# EAGLE board AK4493-Combi10 (EAGLE 9.6.2)
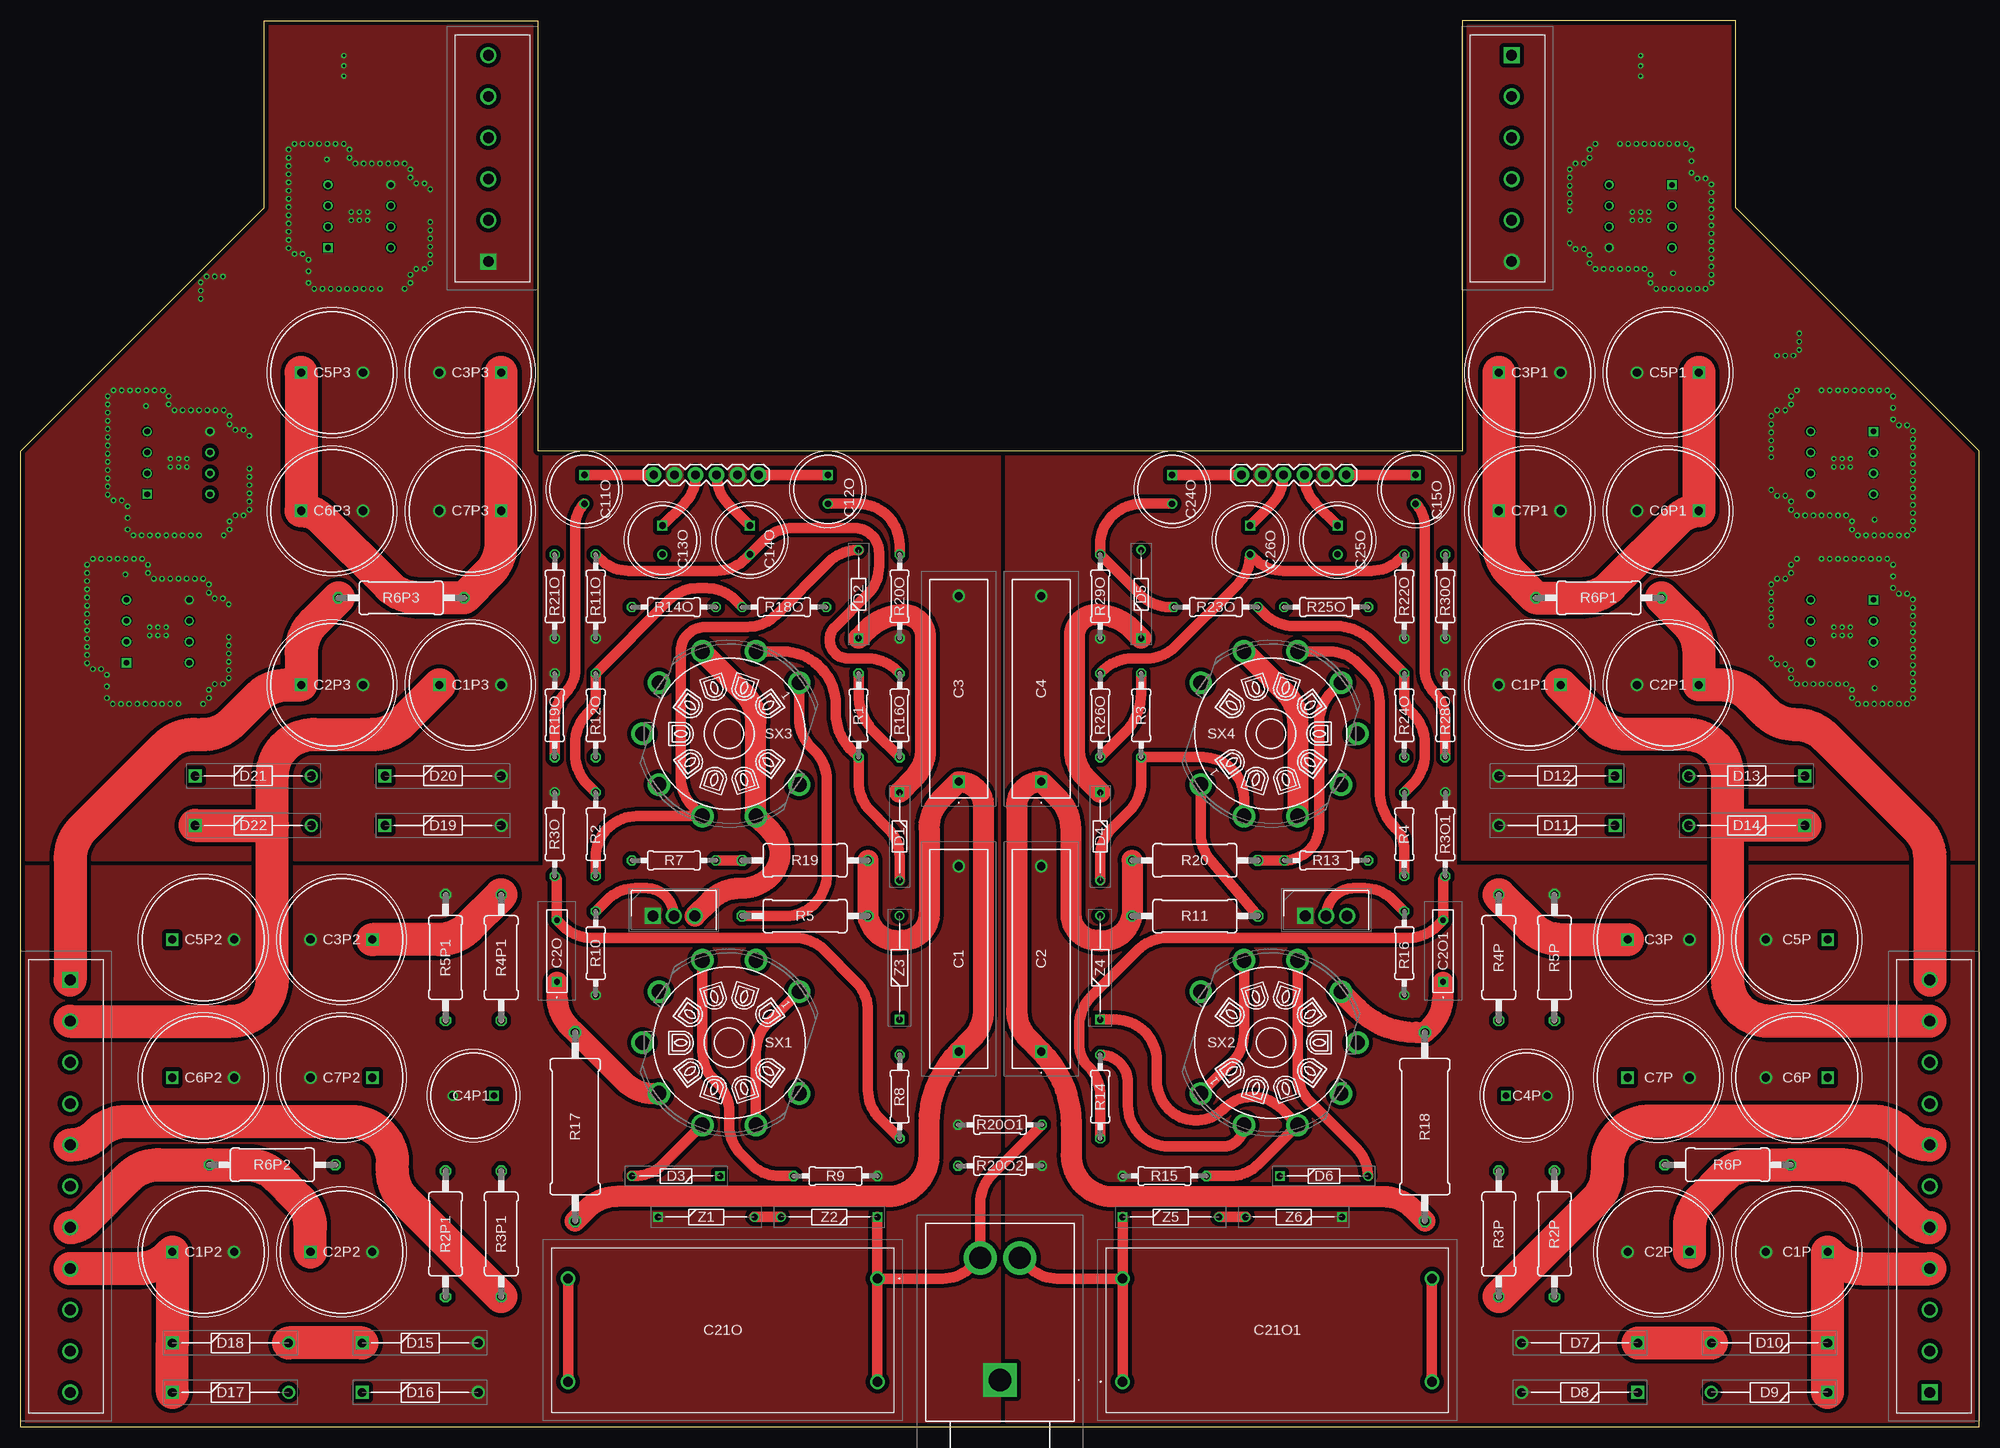
[diagram p3: board, top side]
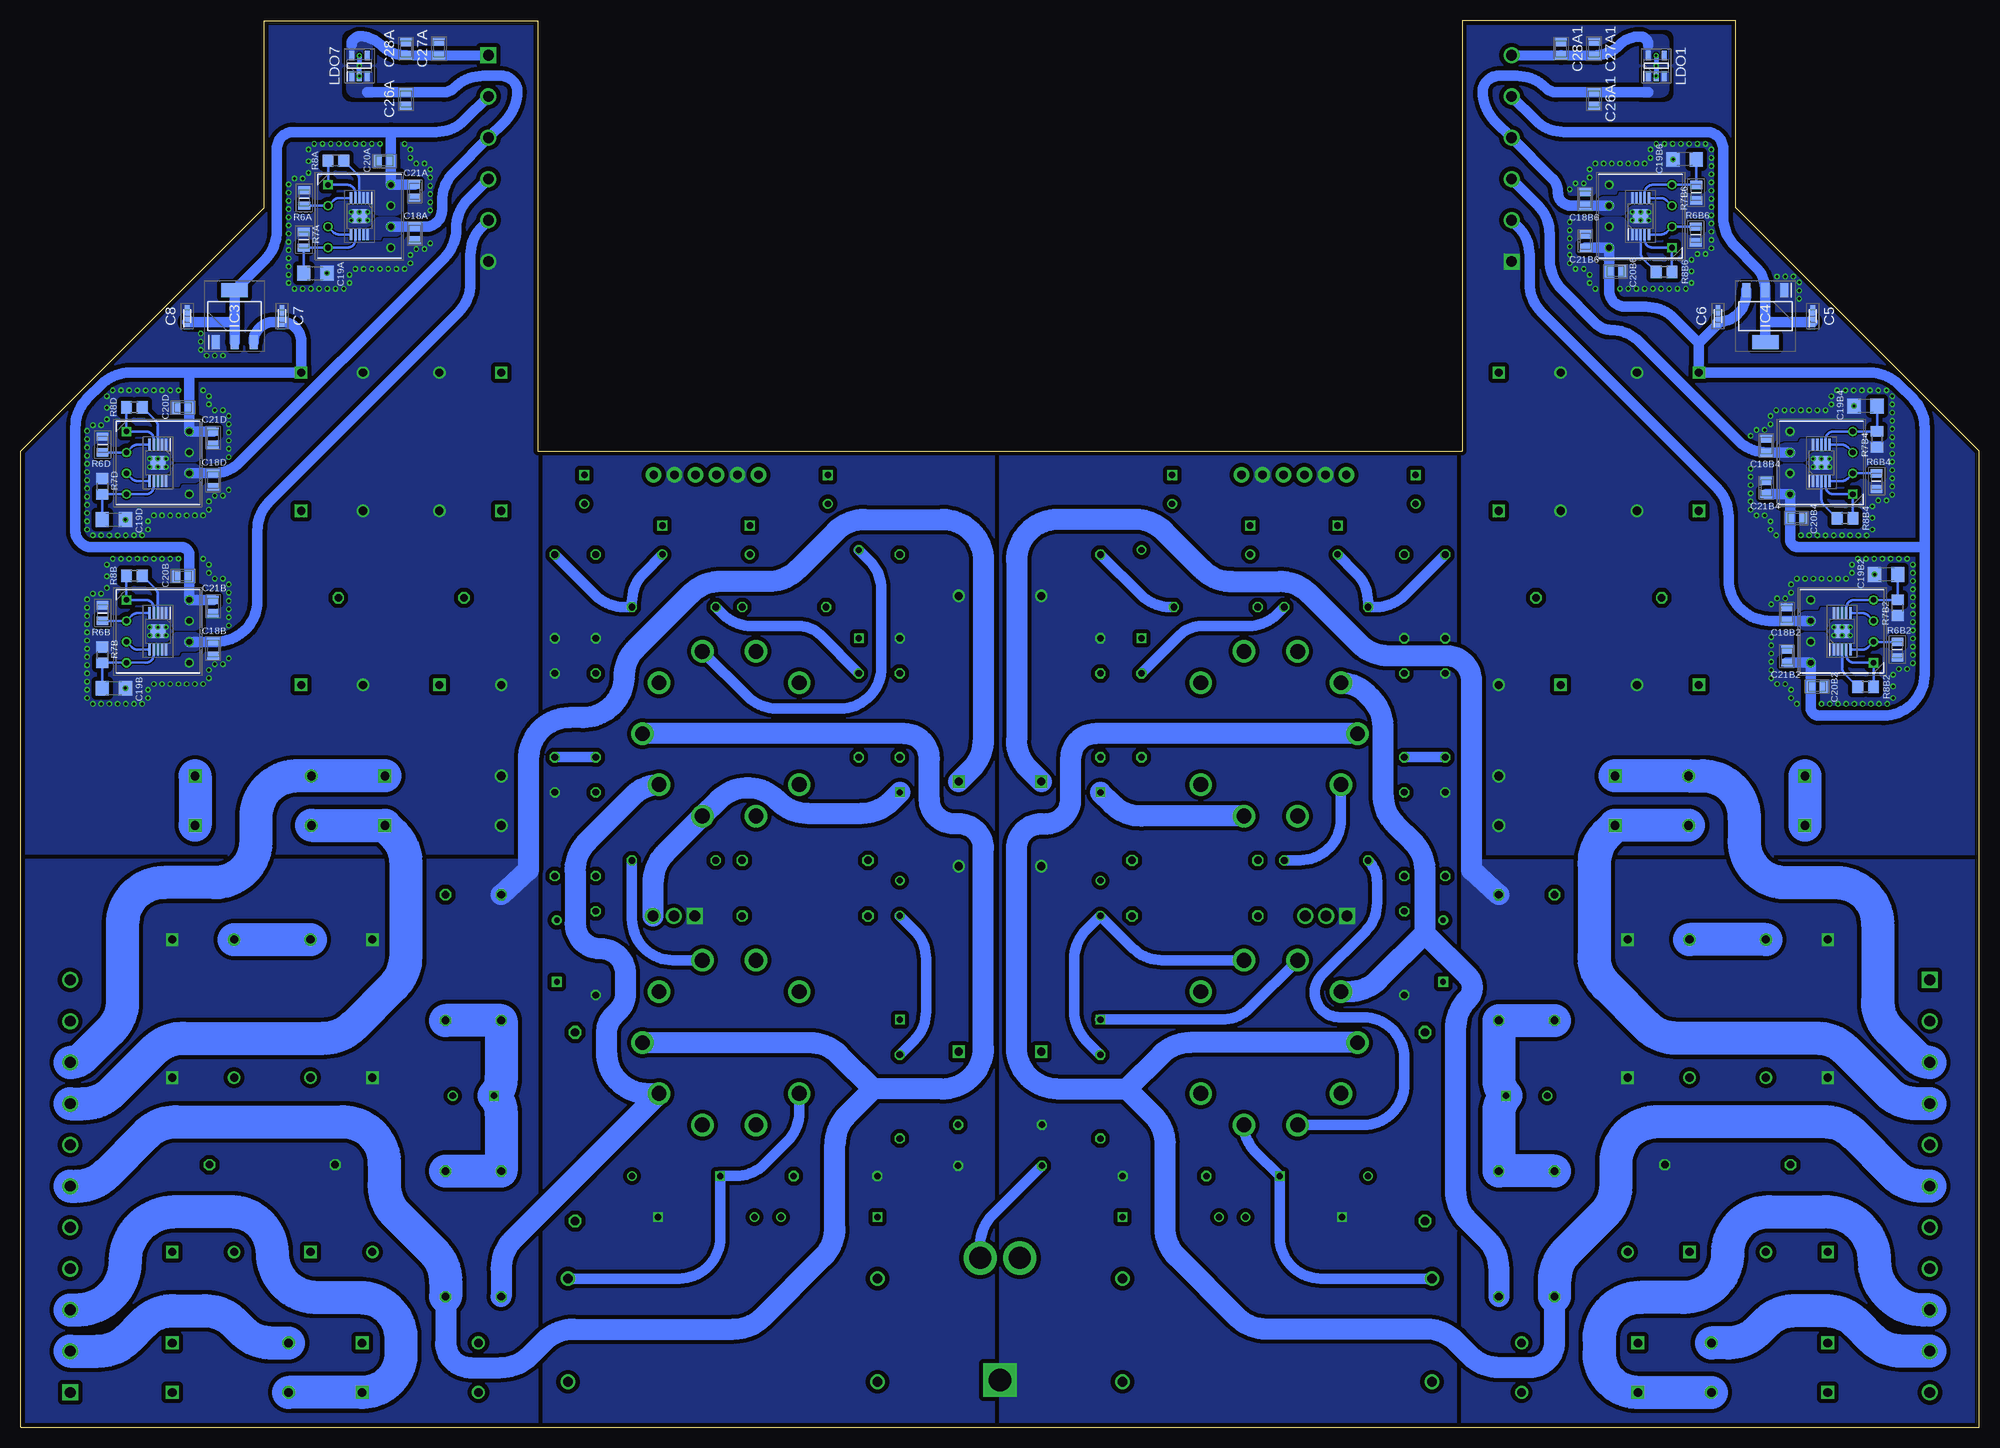
[diagram p4: board, bottom side, seen from below]

Size 237.38 x 170.5 mm. Coordinates in mm from the lower left corner, seen from the top.
Outline: 237.38,0 237.38,118.3 207.83,147.85 207.83,170.5 174.69,170.5 174.69,118.3 62.69,118.3 62.69,170.5 29.55,170.5 29.55,147.85 0,118.3 0,0 237.38,0
Copper layers (1*16): Top 0.035mm / dielectric 1.6mm / Bottom 0.035mm
Design rules "Elecrow_2-layer_PCB_eagle_rule": minimum track width 6mil, minimum drill 12mil, track to track 6mil, track to pad 6mil, pad to pad 6mil, via to via 8mil, smd to smd 0mil, copper to edge 20mil, drill to drill 10mil, minimum pad ring 6mil, minimum via ring 6mil, stop-mask expansion 0mil, vias tented up to drill 100mil, thermal gap 10mil
Net classes: 1 Signal: width 1.27 mm; 2 Power: width 2.54 mm

## Footprints (pad centres in the part's own frame; a part is rotated, then mirrored left to right if it is on the bottom)
MKP4G034705D00KSSD = drill 1 pad 1.5 square: 1 0,0 | drill 1 pad 1.5: 2 22.5,0
CAPPRD750W80D1475H4700 = drill 1 pad 1.5 square: 1 0,0 | drill 1 pad 1.5: 2 7.5,0
MKS4B031002A00JC00 = drill 0.7 pad 1.2 square: 1 0,0 | drill 0.7 pad 1.2: 2 7.5,0
CAPPRD500W60D1025H1750 = drill 0.8 pad 1.2 square: 1 0,0 | drill 0.8 pad 1.2: 2 5,0
CAPPM168X90N = smd 1.3 x 0.6: 1 -0.7,0; 2 0.7,0
CAPPRD350W60D825H1300 = drill 0.8 pad 1.2 square: 1 0,0 | drill 0.8 pad 1.2: 2 3.5,0
CAPC2013X140N = smd 0.96 x 1.44: 1 -0.82,0; 2 0.82,0
C1206 = smd 1.6 x 1.8: 1 -1.4,0; 2 1.4,0 | drill 0.35: DGND 1.4,0
CAPC2012X135N = smd 0.96 x 1.39: 1 -0.79,0; 2 0.79,0
DCP4G056007GD4KSSD = drill 1.2 pad 1.8: 1 0,0; 2 37.5,0; 3 37.5,12.5; 4 0,12.5
DIOAD1068W53L380D172 = drill 0.75 pad 1.15 square: 1 0,0 | drill 0.75 pad 1.15: 2 10.7,0
DIOAD1405W86L465D235 = drill 1.05 pad 1.575 square: 1 0,0 | drill 1.05 pad 1.575: 2 14.1,0
SOP50P490X110-11N = smd 1.425 x 0.3: 1 -2.212,1; 2 -2.212,0.5; 3 -2.212,0; 4 -2.212,-0.5; 5 -2.212,-1; 6 2.212,-1; 7 2.212,-0.5; 8 2.212,0; 9 2.212,0.5; 10 2.212,1 | smd 1.68 x 1.88: 11 0,0 | drill 0.305 pad 0.61: P$1 -0.498,0; P$2 0.498,0; P$3 -0.498,0.995; P$4 0.498,0.995; P$5 -0.498,-0.995; P$6 0.498,-0.995
SOT230P700X180-4N = smd 1.75 x 0.95: 1 -3.15,2.3; 2 -3.15,0; 3 -3.15,-2.3 | smd 1.75 x 3.2: 4 3.15,0
DIPS762W51P254L1016H390Q8N = drill 0.7 pad 1.1 square: 1 0,0 | drill 0.7 pad 1.1: 2 0,-2.54; 3 0,-5.08; 4 0,-7.62; 5 7.62,-7.62; 6 7.62,-5.08; 7 7.62,-2.54; 8 7.62,0
1X06 = drill 1.016 pad 1.88: 1 0,0; 2 2.54,0; 3 5.08,0; 4 7.62,0; 5 10.16,0; 6 12.7,0
SJ63033A = drill 2.69 pad 4.035 square: 1 0,0 | drill 2.69 pad 4.035: 2 14.8,-2.4; 3 14.8,2.4
1935255 = drill 1.3 pad 1.95 square: 1 0,0 | drill 1.3 pad 1.95: 2 5,0; 3 10,0; 4 15,0; 5 20,0; 6 25,0; 7 30,0; 8 35,0; 9 40,0; 10 45,0; 11 50,0
1935200 = drill 1.3 pad 1.95 square: 1 0,0 | drill 1.3 pad 1.95: 2 5,0; 3 10,0; 4 15,0; 5 20,0; 6 25,0
SOT95P280X145-5N = smd 1.2 x 0.6: 1 -1.25,0.95; 2 -1.25,0; 3 -1.25,-0.95; 4 1.25,-0.95; 5 1.25,0.95 | drill 0.305 pad 0.61: DGND -1.25,0; DGND2 0,0; DGND3 1.25,0
0207/10 = drill 0.813 octagon: 1 -5.08,0; 2 5.08,0
0411/15 = drill 0.914 octagon: 1 -7.62,0; 2 7.62,0
RESC2012X60N = smd 1 x 1.4: 1 -0.95,0; 2 0.95,0
RESC2012X65N = smd 1 x 1.45: 1 -0.95,0; 2 0.95,0
R0805 = smd 1.3 x 1.5: 1 -0.95,0; 2 0.95,0
0617/22 = drill 1.016 octagon: 1 -11.43,0; 2 11.43,0
VT9-PT = drill 1.8 pad 2.4: 1 6.172,8.495; 2 0,10.5; 3 -6.172,8.495; 4 -9.986,3.245; 5 -9.986,-3.245; 6 -6.172,-8.495; 7 0,-10.5; 8 6.172,-8.495; 9 9.986,-3.244
TO254P482X997X2018-3P = drill 1.29 pad 1.935 square: 1 0,0 | drill 1.29 pad 1.935: 2 2.54,0; 3 5.08,0
DIOAD1165W56L425D185 = drill 0.75 pad 1.15 square: 1 0,0 | drill 0.75 pad 1.15: 2 11.7,0
DIOAD1256W56L444D203 = drill 0.75 pad 1.15 square: 1 0,0 | drill 0.75 pad 1.15: 2 12.6,0

## Placement (x,y rotation side)
C1  MKP4G034705D00KSSD  [MKP4G034705D00KSSD]  113.69,45.5 90 top
C1P  68u  [CAPPRD750W80D1475H4700]  219,21.23 180 top
C1P1  68u  [CAPPRD750W80D1475H4700]  186.63,89.97 180 top
C1P2  68u  [CAPPRD750W80D1475H4700]  18.38,21.23 0 top
C1P3  68u  [CAPPRD750W80D1475H4700]  50.74,89.97 0 top
C2  MKP4G034705D00KSSD  [MKP4G034705D00KSSD]  123.69,45.5 90 top
C2O  0.1uF, 35V  [MKS4B031002A00JC00]  64.99,53.95 90 top
C2O1  0.1uF, 35V  [MKS4B031002A00JC00]  172.39,53.95 90 top
C2P  68u  [CAPPRD750W80D1475H4700]  202.25,21.23 180 top
C2P1  68u  [CAPPRD750W80D1475H4700]  203.38,89.97 180 top
C2P2  68u  [CAPPRD750W80D1475H4700]  35.12,21.23 0 top
C2P3  68u  [CAPPRD750W80D1475H4700]  33.99,89.97 0 top
C3  MKP4G034705D00KSSD  [MKP4G034705D00KSSD]  113.69,78.25 90 top
C3P  68u  [CAPPRD750W80D1475H4700]  194.75,59.1 0 top
C3P1  68u  [CAPPRD750W80D1475H4700]  179.13,127.83 0 top
C3P2  68u  [CAPPRD750W80D1475H4700]  42.62,59.1 180 top
C3P3  68u  [CAPPRD750W80D1475H4700]  58.24,127.83 180 top
C4  MKP4G034705D00KSSD  [MKP4G034705D00KSSD]  123.69,78.25 90 top
C4P  UCY2E220MPD1TD  [CAPPRD500W60D1025H1750]  180,40.16 0 top
C4P1  UCY2E220MPD1TD  [CAPPRD500W60D1025H1750]  57.37,40.16 180 top
C5  TCM1A106M8R  [CAPPM168X90N]  20.19,134.68 90 bottom
C5P  68u  [CAPPRD750W80D1475H4700]  219,59.1 180 top
C5P1  68u  [CAPPRD750W80D1475H4700]  203.38,127.83 180 top
C5P2  68u  [CAPPRD750W80D1475H4700]  18.38,59.1 0 top
C5P3  68u  [CAPPRD750W80D1475H4700]  33.99,127.83 0 top
C6  TCM1A106M8R  [CAPPM168X90N]  31.68,134.68 90 bottom
C6P  68u  [CAPPRD750W80D1475H4700]  219,42.35 180 top
C6P1  68u  [CAPPRD750W80D1475H4700]  203.38,111.08 180 top
C6P2  68u  [CAPPRD750W80D1475H4700]  18.38,42.35 0 top
C6P3  68u  [CAPPRD750W80D1475H4700]  33.99,111.08 0 top
C7  TCM1A106M8R  [CAPPM168X90N]  205.7,134.68 90 bottom
C7P  68u  [CAPPRD750W80D1475H4700]  194.75,42.35 0 top
C7P1  68u  [CAPPRD750W80D1475H4700]  179.13,111.08 0 top
C7P2  68u  [CAPPRD750W80D1475H4700]  42.62,42.35 180 top
C7P3  68u  [CAPPRD750W80D1475H4700]  58.24,111.08 180 top
C8  TCM1A106M8R  [CAPPM168X90N]  217.19,134.68 90 bottom
C11O  100uF  [CAPPRD350W60D825H1300]  68.31,115.42 270 top
C12O  100uF  [CAPPRD350W60D825H1300]  97.84,115.42 270 top
C13O  100uF  [CAPPRD350W60D825H1300]  77.77,109.28 270 top
C14O  100uF  [CAPPRD350W60D825H1300]  88.38,109.28 270 top
C15O  100uF  [CAPPRD350W60D825H1300]  169.06,115.42 270 top
C18A  4.7u  [CAPC2013X140N]  189.62,144.69 270 bottom
C18B  4.7u  [CAPC2013X140N]  214.05,94.37 270 bottom
C18B2  4.7u  [CAPC2013X140N]  23.33,98.55 90 bottom
C18B4  4.7u  [CAPC2013X140N]  25.83,118.98 90 bottom
C18B6  4.7u  [CAPC2013X140N]  47.75,148.87 90 bottom
C18D  4.7u  [CAPC2013X140N]  214.05,114.8 270 bottom
C19A  22u  [C1206]  201.66,139.89 0 bottom
C19B  22u  [C1206]  226.08,89.57 0 bottom
C19B2  22u  [C1206]  11.3,103.36 180 bottom
C19B4  22u  [C1206]  13.8,123.78 180 bottom
C19B6  22u  [C1206]  35.72,153.68 180 bottom
C19D  22u  [C1206]  226.08,109.99 0 bottom
C20A  10u  [CAPC2012X135N]  193.29,153.47 180 bottom
C20B  10u  [CAPC2012X135N]  217.72,103.16 180 bottom
C20B2  10u  [CAPC2012X135N]  19.66,89.77 0 bottom
C20B4  10u  [CAPC2012X135N]  22.16,110.2 0 bottom
C20B6  10u  [CAPC2012X135N]  44.08,140.09 0 bottom
C20D  10u  [CAPC2012X135N]  217.72,123.58 180 bottom
C21A  0.1u  [CAPC2012X135N]  189.62,149.8 270 bottom
C21B  0.1u  [CAPC2012X135N]  214.05,99.48 270 bottom
C21B2  0.1u  [CAPC2012X135N]  23.33,93.44 90 bottom
C21B4  0.1u  [CAPC2012X135N]  25.83,113.87 90 bottom
C21B6  0.1u  [CAPC2012X135N]  47.75,143.76 90 bottom
C21D  0.1u  [CAPC2012X135N]  214.05,119.91 270 bottom
C21O  30uF/400V  [DCP4G056007GD4KSSD]  103.84,18 180 top
C21O1  30uF/400V  [DCP4G056007GD4KSSD]  133.54,5.5 0 top
C24O  100uF  [CAPPRD350W60D825H1300]  139.54,115.42 270 top
C25O  100uF  [CAPPRD350W60D825H1300]  159.61,109.28 270 top
C26A  4.7u, Ceramic Capacitor X7R  [CAPC2013X140N]  190.69,161 270 bottom
C26A1  4.7u, Ceramic Capacitor X7R  [CAPC2013X140N]  46.69,161 270 bottom
C26O  100uF  [CAPPRD350W60D825H1300]  149,109.28 270 top
C27A  4.7u, Ceramic Capacitor X7R  [CAPC2013X140N]  186.69,167.09 90 bottom
C27A1  4.7u, Ceramic Capacitor X7R  [CAPC2013X140N]  46.69,167.09 90 bottom
C28A  0.1u, Ceramic Capacitor X7R  [CAPC2012X135N]  190.69,167.09 90 bottom
C28A1  0.1u, Ceramic Capacitor X7R  [CAPC2012X135N]  50.69,167.09 90 bottom
D1  1N4148-T50R  [DIOAD1068W53L380D172]  106.51,76.95 270 top
D2  1N4148-T50R  [DIOAD1068W53L380D172]  101.54,95.62 90 top
D3  1N4148-T50R  [DIOAD1068W53L380D172]  84.78,30.42 180 top
D4  1N4148-T50R  [DIOAD1068W53L380D172]  130.83,76.95 270 top
D5  1N4148-T50R  [DIOAD1068W53L380D172]  135.8,95.62 90 top
D6  1N4148-T50R  [DIOAD1068W53L380D172]  152.59,30.42 0 top
D7  1N4007FFG  [DIOAD1405W86L465D235]  196,10.2 180 top
D8  1N4007FFG  [DIOAD1405W86L465D235]  196,4.2 180 top
D9  1N4007FFG  [DIOAD1405W86L465D235]  219,4.2 180 top
D10  1N4007FFG  [DIOAD1405W86L465D235]  219,10.2 180 top
D11  1N4007FFG  [DIOAD1405W86L465D235]  193.23,72.94 180 top
D12  1N4007FFG  [DIOAD1405W86L465D235]  193.23,78.94 180 top
D13  1N4007FFG  [DIOAD1405W86L465D235]  216.23,78.94 180 top
D14  1N4007FFG  [DIOAD1405W86L465D235]  216.23,72.94 180 top
D15  1N4007FFG  [DIOAD1405W86L465D235]  41.38,10.2 0 top
D16  1N4007FFG  [DIOAD1405W86L465D235]  41.38,4.2 0 top
D17  1N4007FFG  [DIOAD1405W86L465D235]  18.38,4.2 0 top
D18  1N4007FFG  [DIOAD1405W86L465D235]  18.38,10.2 0 top
D19  1N4007FFG  [DIOAD1405W86L465D235]  44.14,72.94 0 top
D20  1N4007FFG  [DIOAD1405W86L465D235]  44.14,78.94 0 top
D21  1N4007FFG  [DIOAD1405W86L465D235]  21.14,78.94 0 top
D22  1N4007FFG  [DIOAD1405W86L465D235]  21.14,72.94 0 top
IC1  LT3042  [SOP50P490X110-11N]  220.74,116.89 270 bottom
IC2  LT3042  [SOP50P490X110-11N]  196.31,146.78 270 bottom
IC3  LM1117MPX-5.0_NOPB  [SOT230P700X180-4N]  211.44,134.68 90 bottom
IC4  LM1117MPX-5.0_NOPB  [SOT230P700X180-4N]  25.93,134.68 270 bottom
IC5  LT3042  [SOP50P490X110-11N]  220.74,96.46 270 bottom
IC6  LT3042  [SOP50P490X110-11N]  16.64,96.46 90 bottom
IC8  LT3042  [SOP50P490X110-11N]  19.14,116.89 90 bottom
IC10  LT3042  [SOP50P490X110-11N]  41.06,146.78 90 bottom
J1  XR2A-0811-N  [DIPS762W51P254L1016H390Q8N]  224.55,120.7 0 bottom
J2  [1X06]  147.95,115.42 0 top
J3  SJ-63033A  [SJ63033A]  118.69,5.7 90 top
J4  1935255  [1935255]  6,54.2 270 top
J5  XR2A-0811-N  [DIPS762W51P254L1016H390Q8N]  200.12,150.59 0 bottom
J6  1935255  [1935255]  231.38,4.2 90 top
J7  1935200  [1935200]  180.69,166.3 270 top
J8  XR2A-0811-N  [DIPS762W51P254L1016H390Q8N]  12.83,92.65 180 bottom
J9  1935200  [1935200]  56.69,141.3 90 top
J10  XR2A-0811-N  [DIPS762W51P254L1016H390Q8N]  15.33,113.08 180 bottom
J12  XR2A-0811-N  [DIPS762W51P254L1016H390Q8N]  37.25,142.97 180 bottom
J13  [1X06]  89.42,115.42 180 top
J17  XR2A-0811-N  [DIPS762W51P254L1016H390Q8N]  224.55,100.27 0 bottom
LDO1  LP5907-1.8V  [SOT95P280X145-5N]  39.16,165.02 90 bottom
LDO7  LP5907-1.8V  [SOT95P280X145-5N]  196.31,165.02 90 bottom
R1  1k  [0207/10]  101.54,86.28 90 top
R2  1k  [0207/10]  69.69,71.87 90 top
R2P  220  [0411/15]  185.88,23.41 270 top
R2P1  220  [0411/15]  51.5,23.41 270 top
R3  1k  [0207/10]  135.8,86.28 90 top
R3O  1M*  [0207/10]  64.72,71.87 90 top
R3O1  1M*  [0207/10]  172.66,71.87 90 top
R3P  220  [0411/15]  179.13,23.41 90 top
R3P1  220  [0411/15]  58.24,23.41 90 top
R4  1k  [0207/10]  167.69,71.87 90 top
R4P  300k  [0411/15]  179.13,56.91 90 top
R4P1  300k  [0411/15]  58.24,56.91 90 top
R5  15k  [0411/15]  95.07,61.95 0 top
R5P  100k  [0411/15]  185.88,56.91 270 top
R5P1  100k  [0411/15]  51.5,56.91 270 top
R6A  1k  [RESC2012X60N]  203.01,149 90 bottom
R6B  1k  [RESC2012X60N]  227.43,98.68 90 bottom
R6B2  1k  [RESC2012X60N]  9.95,94.24 270 bottom
R6B4  1k  [RESC2012X60N]  12.45,114.67 270 bottom
R6B6  1k  [RESC2012X60N]  34.37,144.56 270 bottom
R6D  1k  [RESC2012X60N]  227.43,119.11 90 bottom
R6P  330  [0411/15]  206.88,31.79 0 top
R6P1  330  [0411/15]  191.26,100.53 0 top
R6P2  330  [0411/15]  30.5,31.79 180 top
R6P3  330  [0411/15]  46.12,100.53 180 top
R7  1k  [0207/10]  79.16,68.7 0 top
R7A  33k  [RESC2012X65N]  203.06,143.92 90 bottom
R7B  33k  [R0805]  227.48,93.6 90 bottom
R7B2  33k  [R0805]  9.9,99.32 270 bottom
R7B4  33k  [R0805]  12.4,119.75 270 bottom
R7B6  33k  [RESC2012X65N]  34.32,149.64 270 bottom
R7D  33k  [R0805]  227.48,114.03 90 bottom
R8  1k  [0207/10]  106.51,40.05 270 top
R8A  200k  [R0805]  199.17,153.52 180 bottom
R8B  200k  [R0805]  223.6,103.21 180 bottom
R8B2  200k  [R0805]  13.78,89.72 0 bottom
R8B4  200k  [R0805]  16.28,110.15 0 bottom
R8B6  200k  [R0805]  38.2,140.04 0 bottom
R8D  200k  [R0805]  223.6,123.63 180 bottom
R9  249  [0207/10]  98.76,30.42 180 top
R10  76.8  [0207/10]  69.69,57.45 90 top
R11  15k  [0411/15]  142.31,61.95 180 top
R11O  10k  [0207/10]  69.69,100.7 270 top
R12O  182  [0207/10]  69.69,86.28 270 top
R13  1k  [0207/10]  158.21,68.7 180 top
R14  1k  [0207/10]  130.83,40.05 270 top
R14O  182  [0207/10]  79.16,99.4 180 top
R15  249  [0207/10]  138.62,30.42 0 top
R16  76.8  [0207/10]  167.69,57.45 90 top
R16O  182  [0207/10]  106.51,86.28 90 top
R17  402  [0617/22]  67.2,36.42 90 top
R18  402  [0617/22]  170.17,36.42 270 top
R18O  182  [0207/10]  92.53,99.4 0 top
R19  15k  [0411/15]  95.07,68.7 0 top
R19O  10k  [0207/10]  64.72,86.28 270 top
R20  15k  [0411/15]  142.31,68.7 0 top
R20O  10k  [0207/10]  106.51,100.7 270 top
R20O1  10k  [0207/10]  118.69,36.65 0 top
R20O2  10k  [0207/10]  118.69,31.68 180 top
R21O  10k  [0207/10]  64.72,100.7 90 top
R22O  10k  [0207/10]  167.69,100.7 270 top
R23O  182  [0207/10]  144.85,99.4 180 top
R24O  182  [0207/10]  167.69,86.28 270 top
R25O  182  [0207/10]  158.21,99.4 0 top
R26O  182  [0207/10]  130.83,86.28 90 top
R28O  10k  [0207/10]  172.66,86.28 270 top
R29O  10k  [0207/10]  130.83,100.7 270 top
R30O  10k  [0207/10]  172.66,100.7 90 top
SX1  VT9-PT  [VT9-PT]  85.87,46.6 342 top
SX2  VT9-PT  [VT9-PT]  151.51,46.6 162 top
SX3  VT9-PT  [VT9-PT]  85.87,84.05 342 top
SX4  VT9-PT  [VT9-PT]  151.51,84.05 162 top
U1  LM317MTG  [TO254P482X997X2018-3P]  76.62,61.95 0 top
U2  LM317MTG  [TO254P482X997X2018-3P]  155.67,61.95 0 top
Z1  [DIOAD1165W56L425D185]  77.23,25.45 0 top
Z2  [DIOAD1165W56L425D185]  103.84,25.45 180 top
Z3  1N750  [DIOAD1256W56L444D203]  106.51,49.39 90 top
Z4  1N750  [DIOAD1256W56L444D203]  130.83,49.39 90 top
Z5  [DIOAD1165W56L425D185]  133.54,25.45 0 top
Z6  [DIOAD1165W56L425D185]  160.14,25.45 180 top

## Tracks (layer width: path | path; a pad name or v marks a point on that pad's centre or on a via)
6.3_VAC_BLU/1
  Bottom 4: J4.4 7.62,39.2 arc45 11.15,40.66 16.16,45.67 arc-45 19.69,47.13 36.75,47.13 arc45 40.29,48.6 45.22,53.54 arc45 46.69,57.07 46.69,68.32 arc45 45.22,71.86 D19.1 D22.2
6.3_VAC_BLU/2
  Bottom 4: J6.8 229.76,39.2 arc-45 226.22,40.66 221.22,45.67 arc45 217.68,47.13 200.63,47.13 arc-45 197.09,48.6 192.15,53.54 arc-45 190.69,57.07 190.69,68.32 arc-45 192.15,71.86 D11.1 D14.2
6.3_VAC_GRN/1
  Bottom 4: J4.3 arc45 7.71,44.91 10.87,48.07 arc45 12.34,51.61 12.34,61 arc-90 17.34,66 23.5,66 arc90 28.5,71 28.5,73.94 arc-90 33.5,78.94 D21.2 D20.1
6.3_VAC_GRN/2
  Bottom 4: D12.1 D13.2 203.88,78.94 arc-90 208.88,73.94 208.88,71 arc90 213.88,66 220.04,66 arc-90 225.04,61 225.04,51.61 arc45 226.51,48.07 229.67,44.91 arc45 J6.9
66.3VAC/BRN/1
  Top 4: R3P1.1 46.53,27.51 arc-45 45.06,31.05 45.06,32.05 arc90 40.06,37.05 12.81,37.05 arc45 9.28,35.59 9.22,35.53 arc-45 J4.5
  Bottom 2.54: R3P1.1 58.24,19.23 arc-45 59.71,22.77 62.02,25.08 arc45 63.49,28.62 63.49,48.33 arc45 62.02,51.86 arc-90 62.02,54.68 67.2,59.86 | 67.2,59.86 72.82,54.24 arc45 76.36,52.77 SX1.4 | SX3.4 arc45 74.29,88.94 73.75,88.41 arc45 72.29,84.87 72.29,76.67 arc-45 70.82,73.14 68.67,70.98 arc45 67.2,67.44 67.2,59.86
66.3VAC/BRN/2
  Top 4: R3P.1 190.85,27.51 arc45 192.31,31.05 192.31,32.05 arc-90 197.31,37.05 224.56,37.05 arc-45 228.1,35.59 228.15,35.53 arc45 J6.7
  Bottom 2.54: R3P.1 179.13,19.23 arc45 177.67,22.77 SX2.4 161.39,40.43 arc90 166.39,45.43 166.39,47.76 arc45 165.51,49.88 164.97,50.42 arc-45 164.09,52.54 164.09,55 arc-90 167.09,58 167.17,58 arc90 170.17,61 170.17,67.44 arc45 168.71,70.98 163.09,76.6 arc45 SX4.4
66.3VAC/ORG/1
  Bottom 2.54: 103.32,40.99 99.18,45.14 arc45 95.64,46.6 SX1.5 | 103.32,40.99 111.69,40.99 arc90 116.69,45.99 116.69,70.12 arc90 113.69,73.12 113.12,73.12 arc-90 110.12,76.12 110.12,81.05 arc90 107.12,84.05 SX3.5 | 103.32,40.99 100.15,37.82 arc45 98.69,34.28 98.69,24.14 arc-45 97.22,20.61 89.95,13.33 arc-45 86.42,11.87 67,11.87 arc45 63.47,10.41 61.73,8.66 arc-45 58.19,7.2 54.5,7.2 arc-90 51.5,10.2 R2P1.2 | SX3.5
  Bottom 4: R2P1.2 51.5,17.72 arc45 50.04,21.26 45.53,25.77 arc-45 44.06,29.3 44.06,32 arc90 39.06,37 18.76,37 arc45 15.22,35.54 10.35,30.66 arc-45 6.82,29.2 J4.6
66.3VAC/ORG/2
  Bottom 2.54: SX4.5 130.26,84.05 arc90 127.26,81.05 127.26,76.12 arc-90 124.26,73.12 123.69,73.12 arc90 120.69,70.12 120.69,45.99 arc90 125.69,40.99 134.05,40.99 | SX2.5 141.74,46.6 arc45 138.2,45.14 134.05,40.99 | 134.05,40.99 137.22,37.82 arc-45 138.69,34.28 138.69,24.14 arc45 140.15,20.61 147.43,13.33 arc45 150.96,11.87 170.37,11.87 arc-45 173.91,10.41 175.65,8.66 arc45 179.19,7.2 182.88,7.2 arc90 185.88,10.2 R2P.2
  Bottom 4: R2P.2 185.88,17.72 arc-45 187.34,21.26 191.85,25.77 arc45 193.31,29.3 193.31,32 arc-90 198.31,37 218.62,37 arc-45 222.15,35.54 227.02,30.66 arc45 230.56,29.2 J6.6
115_VAC_BLK/1
  Top 4: D15.1 D18.2
  Bottom 4: D18.2 30.4,10.2 arc-45 26.87,11.66 25.9,12.64 arc45 22.36,14.1 18.46,14.1 arc45 14.92,12.64 12.95,10.66 arc-45 9.42,9.2 J4.10
115_VAC_BLK/2
  Top 4: D7.1 D10.2
  Bottom 4: D10.2 206.97,10.2 arc45 210.51,11.66 211.48,12.64 arc-45 215.02,14.1 218.92,14.1 arc-45 222.45,12.64 224.42,10.66 arc45 227.96,9.2 J6.2
115_VAC_RED/1
  Bottom 4: D17.2 D16.1 arc90 46.09,8.91 46.09,10.71 arc90 41.09,15.71 35.88,15.71 arc-90 30.5,21.1 arc90 25.5,26.1 18.69,26.1 arc90 12.69,20.1 arc-90 6.79,14.2 J4.9
115_VAC_RED/2
  Bottom 4: D9.2 D8.1 arc-90 191.29,8.91 191.29,10.71 arc-90 196.29,15.71 201.49,15.71 arc90 206.88,21.1 arc-90 211.88,26.1 218.69,26.1 arc-90 224.69,20.1 arc90 230.59,14.2 J6.3
+1V8/1
  Bottom 1.272: J9.6 56.69,166.27 C28A1.1 C27A1.1 arc-45 43.61,167.54 arc45 41.14,168.57 arc90 40.11,167.54
  pour Bottom (no thermals): 37.58,165.92 37.58,167.86 arc-90 38.58,168.86 39.75,168.86 arc-90 40.75,167.86 40.75,165.92 arc-90 40.5,165.67 37.83,165.67 arc-90
+1V8/2
  Bottom 1.272: J7.1 C27A.1 190.66,166.3 C28A.1 arc45 193.76,167.57 arc-45 196.24,168.6 arc-90 197.26,167.57
  pour Bottom (no thermals): 197.9,165.92 197.9,167.86 arc90 196.9,168.86 195.73,168.86 arc90 194.73,167.86 194.73,165.92 arc90 194.98,165.67 197.65,165.67 arc90
+3V3/1
  Bottom 1.272: J12.6 C18B6.1 49.48,148.05 arc90 51.07,149.65 arc-45 51.8,151.41 J9.4 58.72,158.34 arc45 60.19,161.87 arc90 58.26,163.8 56.06,163.8 arc45 52.52,162.34 arc-45 51.28,161.82 C26A1.1 40.11,161.82
  pour Bottom (no thermals): 41.39,148.28 41.39,149.71 43.5,149.71 arc-90 43.73,149.48 arc90 43.96,149.25 45.39,149.25 arc-90 46.39,148.25 46.39,147.86 arc-90 45.39,146.86 43.44,146.86 arc-90 42.73,147.57 arc90 42.02,148.28
  pour Bottom (no thermals): 40.75,161.18 38.58,161.18 arc-90 37.58,162.18 37.58,164.12 arc-90 37.83,164.37 40.5,164.37 arc-90 40.75,164.12
+3V3/2
  Bottom 1.272: J5.6 C18A.1 188.31,145.51 arc-90 186.31,147.51 186.31,148.61 arc45 184.84,152.15 J7.3 178.65,158.34 arc-45 177.19,161.87 arc-90 179.12,163.8 181.32,163.8 arc-45 184.85,162.34 arc45 186.1,161.82 C26A.1 195.36,161.82
  pour Bottom (no thermals): 195.99,145.28 195.99,143.86 193.88,143.86 arc-90 193.64,144.09 arc90 193.41,144.32 191.98,144.32 arc-90 190.98,145.32 190.98,145.71 arc-90 191.98,146.71 193.93,146.71 arc-90 194.64,145.99 arc90 195.36,145.28
  pour Bottom (no thermals): 194.73,161.18 196.9,161.18 arc90 197.9,162.18 197.9,164.12 arc90 197.65,164.37 194.98,164.37 arc90 194.73,164.12
+5V/L/1
  Bottom 1.272: J1.6 C18D.1 arc-45 210.81,116.96 186.05,141.72 arc-45 184.59,145.25 184.59,145.33 arc45 183.12,148.87 J7.4
  pour Bottom (no thermals): 220.41,115.39 220.41,113.96 218.3,113.96 arc-90 218.07,114.19 arc90 217.84,114.42 216.41,114.42 arc-90 215.41,115.42 215.41,115.81 arc-90 216.41,116.81 218.36,116.81 arc-90 219.07,116.1 arc90 219.78,115.39
+5V/L/2
  Bottom 1.272: J17.6 C18B.1 213.69,95.19 arc-90 208.69,100.19 208.69,108.68 arc45 207.22,112.22 184.33,135.11 arc-45 182.86,138.65 182.86,142.05 arc45 181.4,145.59 J7.5
  pour Bottom (no thermals): 220.41,94.96 220.41,93.54 218.3,93.54 arc-90 218.07,93.77 arc90 217.84,94 216.41,94 arc-90 215.41,95 215.41,95.39 arc-90 216.41,96.39 218.36,96.39 arc-90 219.07,95.68 arc90 219.78,94.96
+5V/L/3
  Bottom 0.305: IC2.3 196.31,151.2 arc-45 196.61,151.91 R8A.1
  Bottom 1.272: C21A.1 J5.8 C20A.1 192.5,156.99 | 192.5,156.99 204.32,156.99 arc-90 206.32,154.99 206.32,145.02 arc45 207.78,141.49 IC3.4 211.44,133.98 | 192.5,156.99 187.07,156.99 arc-45 183.53,158.46 J7.2 | IC3.2 211.44,133 211.44,133.98 | C8.1 211.44,133.98
  pour Bottom (no thermals): 196.49,148.28 196.49,151.11 arc90 195.49,152.11 191.98,152.11 arc90 190.98,151.11 190.98,147.86 arc90 191.98,146.86 193.93,146.86 arc90 194.64,147.57 arc-90 195.36,148.28
+5V/R/1
  Bottom 1.272: J9.3 53.54,148.16 arc45 52.08,144.62 52.08,141.46 arc-45 50.61,137.93 46.4,133.72 arc-45 44.68,133 arc45 41.14,131.54 29.13,119.53 arc-45 C18B4.1 J10.6
  pour Bottom (no thermals): 19.46,118.39 19.46,119.81 21.58,119.81 arc-90 21.81,119.58 arc90 22.04,119.35 23.47,119.35 arc-90 24.47,118.35 24.47,117.96 arc-90 23.47,116.96 21.52,116.96 arc-90 20.81,117.68 arc90 20.1,118.39
+5V/R/2
  Bottom 1.27: J8.6 C18B2.1 25.39,97.73 arc90 30.39,102.73 30.39,103.11
  Bottom 1.272: J9.2 55.98,145.59 arc45 54.51,142.05 54.51,138.65 arc-45 53.05,135.11 31.85,113.92 arc45 30.39,110.38 30.39,103.11
  pour Bottom (no thermals): 16.96,97.96 16.96,99.39 19.08,99.39 arc-90 19.31,99.16 arc90 19.54,98.93 20.97,98.93 arc-90 21.97,97.93 21.97,97.54 arc-90 20.97,96.54 19.02,96.54 arc-90 18.31,97.25 arc90 17.6,97.96
+5V/R/3
  Bottom 1.272: J9.5 53.85,158.46 arc-45 50.31,156.99 33.06,156.99 arc90 31.06,154.99 31.06,146.66 arc-45 29.59,143.13 27.09,140.63 arc45 IC4.2 25.93,133.98 | IC4.4 25.93,133 25.93,133.98 | C5.1 25.93,133.98
+240VDC/1
  Top 2.54: R19.2 R5.2 arc90 106.89,59 arc90 110.1,62.21 110.1,72.59 arc-45 111.57,76.13 C3.1 arc-90 116.69,75.25 116.69,50.57 arc-45 115.22,47.04 C1.1 arc45 110.06,36.74 110.06,32.94 arc-90 105.06,27.94 72.23,27.94 arc45 68.69,26.48 R17.1
  Top 4: R4P1.2 54.27,60.56 arc-45 50.74,59.1 C3P2.1
  Bottom 2.54: C3.1 115.22,79.79 arc45 116.69,83.32 116.69,105.04 arc90 111.69,110.04 102.3,110.04 arc45 98.76,108.57 94.15,103.96 arc-45 90.62,102.5 84.76,102.5 arc45 81.22,101.04 75.14,94.96 arc-45 71.61,93.49 64.55,93.49 arc90 61.55,90.49 61.55,67.53 R4P1.2
  pour Bottom (isolate 0.5, no thermals): 0,0 62.69,0 62.69,68.73 0,68.73
+240VDC/2
  Top 2.54: R20.1 R11.2 arc-90 130.49,59 arc-90 127.28,62.21 127.28,72.59 arc45 125.81,76.13 C4.1 arc90 120.69,75.25 120.69,50.57 arc45 122.15,47.04 C2.1 arc-45 127.32,36.74 127.32,32.94 arc90 132.32,27.94 165.15,27.94 arc-45 168.68,26.48 R18.2
  Top 4: R4P.2 183.1,60.56 arc45 186.64,59.1 C3P.1
  Bottom 2.54: C4.1 122.15,79.79 arc-45 120.69,83.32 120.69,105.04 arc-90 125.69,110.04 135.08,110.04 arc-45 138.62,108.57 143.22,103.96 arc45 146.76,102.5 152.62,102.5 arc-45 156.15,101.04 162.88,94.31 arc-45 164.25,91 arc90 169.25,86 170.83,86 arc-90 175.83,81 175.83,67.53 R4P.2
  pour Bottom (isolate 0.5, no thermals): 237.38,0 174.69,0 174.69,68.73 237.38,68.73
AGND/1
  Bottom 4: C5P2.2 C3P2.2
  pour Top (isolate 0.5, rank 5, no thermals): 118.69,0 62.69,0 62.69,118.3 118.69,118.3
  pour Top (isolate 0.5, rank 5, no thermals): 0,0 62.69,0 62.69,68.73 0,68.73
  pour Bottom (isolate 0.5, rank 5, no thermals): 118.69,0 62.69,0 62.69,118.3 118.69,118.3
AGND/2
  Bottom 4: C5P.2 C3P.2
  pour Top (isolate 0.5, rank 5, no thermals): 237.38,0 174.69,0 174.69,68.73 237.38,68.73
  pour Top (isolate 0.5, rank 6, no thermals): 118.69,0 174.69,0 174.69,118.3 118.69,118.3
  pour Bottom (isolate 0.5, rank 6, no thermals): 118.69,0 174.69,0 174.69,118.3 118.69,118.3
DGND/1  (via drill 0.35)
  Bottom 0.61: LDO1.DGND3 LDO1.DGND
  other vias: 10.46,91.2 9.76,91.9 19.13,87.68 18.13,87.68 14.15,87.68 15.15,87.68 16.14,87.68 17.14,87.68 13.15,87.68 12.16,87.68 11.16,87.68 10.46,88.38 10.46,89.79 8.06,93.6 8.06,92.6 8.76,91.9 8.06,94.59 8.06,95.59 8.06,96.58 8.06,97.58 8.06,98.58 8.06,99.57 8.06,100.57 8.06,101.56 8.06,102.56 22.82,101.15 23.52,100.45 13.74,105.25 14.73,105.25 15.44,104.55 15.44,103.55 19.13,102.85 18.13,102.85 17.14,102.85 16.14,102.85 8.06,104.55 8.76,105.25 9.76,105.25 10.75,105.25 11.75,105.25 12.74,105.25 8.06,103.55 20.12,102.85 21.12,102.85 22.11,102.85 22.82,102.14 25.22,92.77 25.22,99.74 24.52,100.45 25.22,95.76 25.22,94.76 25.22,93.77 25.22,91.78 25.22,90.78 24.52,90.08 23.52,90.08 22.82,89.38 22.11,87.68 22.82,88.38 12.96,111.62 12.26,112.32 21.63,108.1 20.63,108.1 16.65,108.1 17.65,108.1 18.64,108.1 19.64,108.1 15.65,108.1 14.66,108.1 13.66,108.1 12.96,108.8 12.96,110.21 10.56,114.02 10.56,113.03 11.26,112.32 10.56,115.02 10.56,116.01 10.56,117.01 10.56,118 10.56,119 10.56,119.99 10.56,120.99 10.56,121.99 10.56,122.98 25.32,121.57 26.02,120.87 16.24,125.68 17.23,125.68 17.94,124.97 17.94,123.98 21.63,123.27 20.63,123.27 19.64,123.27 18.64,123.27 10.56,124.97 11.26,125.68 12.26,125.68 13.25,125.68 14.25,125.68 15.24,125.68 10.56,123.98 22.62,123.27 23.62,123.27 24.61,123.27 25.32,122.57 27.72,113.2 27.72,120.17 27.02,120.87 27.72,116.18 27.72,115.19 27.72,114.19 27.72,112.2 27.72,111.21 27.02,110.5 26.02,110.5 25.32,109.8 24.61,108.1 25.32,108.8 34.88,141.51 34.18,142.22 43.55,137.99 42.56,137.99 38.57,137.99 39.57,137.99 40.56,137.99 41.56,137.99 37.58,137.99 36.58,137.99 35.59,137.99 34.88,138.7 34.88,140.11 32.48,143.92 32.48,142.92 33.19,142.22 32.48,144.91 32.48,145.91 32.48,146.9 32.48,147.9 32.48,148.89 32.48,149.89 32.48,150.88 32.48,151.88 32.48,152.87 47.24,151.47 47.94,150.76 38.16,155.57 39.16,155.57 39.86,154.87 39.86,153.87 43.55,153.17 42.56,153.17 41.56,153.17 40.56,153.17 32.48,154.87 33.19,155.57 34.18,155.57 35.18,155.57 36.17,155.57 37.17,155.57 32.48,153.87 44.55,153.17 45.54,153.17 46.54,153.17 47.24,152.46 49.64,143.09 49.64,150.06 48.94,150.76 49.64,146.08 49.64,145.08 49.64,144.09 49.64,142.1 49.64,141.1 48.94,140.4 47.94,140.4 47.24,139.69 46.54,137.99 47.24,138.7 21.83,136.77 21.83,138.77 22.54,139.47 23.53,139.47 24.53,139.47 21.83,137.77
  pour Top (isolate 0.5, rank 4, no thermals): 62.69,68.73 62.69,170.5 29.55,170.5 29.55,147.85 0,118.3 0,68.73
  pour Bottom (isolate 0.5, rank 4, no thermals): 62.69,68.73 62.69,170.5 29.55,170.5 29.55,147.85 0,118.3 0,68.73
  pour Bottom (rank 6, no thermals): 35.73,141.45 35.73,152.11 46.39,152.11 46.39,141.45
  pour Bottom (rank 6, no thermals): 13.81,111.56 13.81,122.22 24.47,122.22 24.47,111.56
  pour Top (no thermals): 11.31,111.56 21.97,111.56 21.97,122.22 11.31,122.22
  pour Top (no thermals): 11.31,91.13 21.97,91.13 21.97,101.79 11.31,101.79
  pour Bottom (rank 6, no thermals): 11.31,91.13 11.31,101.79 21.97,101.79 21.97,91.13
  pour Top (no thermals): 35.73,141.45 46.39,141.45 46.39,152.11 35.73,152.11
DGND/2  (via drill 0.35)
  Bottom 0.61: LDO7.DGND LDO7.DGND2 LDO7.DGND3
  other vias: 226.92,101.73 227.62,101.03 218.25,105.25 219.25,105.25 223.23,105.25 222.23,105.25 221.24,105.25 220.24,105.25 224.22,105.25 225.22,105.25 226.21,105.25 226.92,104.55 226.92,103.14 229.32,99.33 229.32,100.32 228.62,101.03 229.32,98.33 229.32,97.34 229.32,96.34 229.32,95.35 229.32,94.35 229.32,93.36 229.32,92.36 229.32,91.37 229.32,90.37 214.56,91.78 213.86,92.48 223.64,87.68 222.64,87.68 221.94,88.38 221.94,89.38 218.25,90.08 219.25,90.08 220.24,90.08 221.24,90.08 229.32,88.38 228.62,87.68 227.62,87.68 226.63,87.68 225.63,87.68 224.63,87.68 229.32,89.38 217.25,90.08 216.26,90.08 215.26,90.08 214.56,90.78 212.16,100.15 212.16,93.19 212.86,92.48 212.16,97.17 212.16,98.16 212.16,99.16 212.16,101.15 212.16,102.14 212.86,102.85 213.86,102.85 214.56,103.55 215.26,105.25 214.56,104.55 226.92,122.16 227.62,121.45 218.25,125.68 219.25,125.68 223.23,125.68 222.23,125.68 221.24,125.68 220.24,125.68 224.22,125.68 225.22,125.68 226.21,125.68 226.92,124.97 226.92,123.56 229.32,119.75 229.32,120.75 228.62,121.45 229.32,118.76 229.32,117.76 229.32,116.77 229.32,115.77 229.32,114.78 229.32,113.78 229.32,112.79 229.32,111.79 229.32,110.8 214.56,112.2 213.86,112.91 223.64,108.1 222.64,108.1 221.94,108.8 221.94,109.8 218.25,110.5 219.25,110.5 220.24,110.5 221.24,110.5 229.32,108.8 228.62,108.1 227.62,108.1 226.63,108.1 225.63,108.1 224.63,108.1 229.32,109.8 217.25,110.5 216.26,110.5 215.26,110.5 214.56,111.21 212.16,120.58 212.16,113.61 212.86,112.91 212.16,117.59 212.16,118.59 212.16,119.58 212.16,121.57 212.16,122.57 212.86,123.27 213.86,123.27 214.56,123.98 215.26,125.68 214.56,124.97 202.49,152.05 203.2,151.35 193.83,155.57 194.82,155.57 198.8,155.57 197.81,155.57 196.81,155.57 195.82,155.57 199.8,155.57 200.79,155.57 201.79,155.57 202.49,154.87 202.49,153.46 204.9,149.65 204.9,150.64 204.19,151.35 204.9,148.65 204.9,147.66 204.9,146.66 204.9,145.67 204.9,144.67 204.9,143.68 204.9,142.68 204.9,141.68 204.9,140.69 190.14,142.1 189.43,142.8 199.22,137.99 198.22,137.99 197.52,138.7 197.52,139.69 193.83,140.4 194.82,140.4 195.82,140.4 196.81,140.4 204.9,138.7 204.19,137.99 203.2,137.99 202.2,137.99 201.21,137.99 200.21,137.99 204.9,139.69 192.83,140.4 191.84,140.4 190.84,140.4 190.14,141.1 187.73,150.47 187.73,143.5 188.44,142.8 187.73,147.49 187.73,148.48 187.73,149.48 187.73,151.47 187.73,152.46 188.44,153.17 189.43,153.17 190.14,153.87 190.84,155.57 190.14,154.87 215.55,132.58 215.55,130.59 214.84,129.88 213.85,129.88 212.85,129.88 215.55,131.58
  pour Top (no thermals): 201.64,152.11 190.98,152.11 190.98,141.45 201.64,141.45
  pour Bottom (rank 6, no thermals): 226.07,101.79 226.07,91.13 215.41,91.13 215.41,101.79
  pour Top (no thermals): 226.07,101.79 215.41,101.79 215.41,91.13 226.07,91.13
  pour Bottom (rank 6, no thermals): 226.07,122.22 226.07,111.56 215.41,111.56 215.41,122.22
  pour Top (no thermals): 226.07,122.22 215.41,122.22 215.41,111.56 226.07,111.56
  pour Bottom (rank 6, no thermals): 201.64,152.11 201.64,141.45 190.98,141.45 190.98,152.11
  pour Top (isolate 0.5, rank 4, no thermals): 174.69,68.73 174.69,170.5 207.83,170.5 207.83,147.85 237.38,118.3 237.38,68.73
  pour Bottom (isolate 0.5, rank 4, no thermals): 174.69,68.73 174.69,170.5 207.83,170.5 207.83,147.85 237.38,118.3 237.38,68.73
L+
  Top 1.27: R23O.1 150.76,98.56 arc45 154.3,97.1 159.38,97.1 arc-45 163.77,95.28 R24O.1 167.69,88.59 arc45 168.46,86.73 168.71,86.48 arc-45 170.17,82.94 170.17,81.5 arc-45 168.71,77.97 R4.2
L-
  Top 1.27: R3.2 135.8,88.95 arc-45 133.83,84.21 R26O.1
  Bottom 1.27: R25O.1 152.3,98.56 arc-45 148.76,97.1 143.11,97.1 arc45 140.42,95.99 R3.2
L_OUT
  Top 1.27: C21O1.1 C21O1.4 | Z5.1 C21O1.4 | C21O1.4 125.66,18 arc-45 122.12,19.46 J3.2
  Bottom 1.27: J3.2 121.09,22.13 arc45 119.62,25.66 R20O2.2
N$1
  Top 1.27: R7.2 R19.1
  Bottom 1.27: 77.37,73.7 arc90 82.37,68.7 R7.2 | SX3.6 77.37,73.7 | 77.37,73.7
N$2
  Bottom 1.27: R8.1 108.22,46.84 arc45 109.69,50.38 109.69,56.74 arc45 108.22,60.28 Z3.2 102.58,58.05 arc-45 99.04,56.59 SX1.2
N$3
  Top 1.27: SX2.1 146.8,44.22 arc45 148.27,47.75 SX2.8 | C21O1.3 C21O1.2
  Bottom 1.27: C21O1.3 157.59,18 arc-90 152.59,23 D6.1 150.74,30.42 arc-45 147.2,31.89 144.48,34.61 arc-45 143.02,38.14 SX2.1
N$4
  Top 1.27: SX4.2 148.27,76.2 arc90 143.27,81.2 R3.1 135.8,78.22 arc-45 134.33,74.68 132.29,72.64 arc45 130.83,69.1 D4.2
N$5
  Top 1.27: R4.1 167.69,70.04 arc45 166.65,72.54 arc-45 164.69,77.28 164.69,87.93 arc45 163.22,91.46 162.12,92.57 arc45 158.58,94.03 SX4.7
  Bottom 1.27: D5.2 134.53,105.05 arc45 133.06,101.51 133.06,92.1 arc90 138.06,87.1 145.75,87.1 arc45 149.29,88.56 SX4.7
N$6
  Top 1.27: SX3.2 92.29,94.03 arc-90 98.79,87.53 98.79,86.53 arc45 100.61,82.14 R1.1 101.54,78.22 arc45 103.01,74.68 105.05,72.64 arc-45 106.51,69.1 D1.2
N$7
  Top 2.54: D5.1 134.74,96.68 arc45 130.35,98.5 arc90 127.69,95.84 127.69,82.16 arc45 129.15,78.62 D4.1 | SX4.8 153.29,89.01 arc-45 154.76,85.47 SX4.3
  Bottom 2.54: D4.1 131.91,75.86 arc45 135.45,74.4 142.02,74.4 arc45 145.55,75.86 145.72,76.03 arc-90 152.79,76.03 SX4.3 159.29,69.53 arc-45 160.75,65.99 U2.3
N$8
  Top 1.27: SX4.1 143.02,71.95 arc40 144.2,68.72 R11.1
N$9
  Top 1.27: R20.2 R13.2 arc90 157.38,72.94 157.38,85.52 arc-45 158.84,89.06 SX4.6
N$10
  Top 1.27: J13.6 C11O.1
N$11
  Top 1.27: R19O.2 64.72,85.91 arc-45 65.99,88.97 arc45 67.2,91.91 67.2,109.25 arc-45 C11O.2
  Bottom 1.27: R19O.2 R12O.2
N$12
  Top 1.27: J2.6 C15O.1
N$13
  Top 1.27: D2.2 101.48,106.32 arc45 97.94,104.86 91.55,98.46 arc-45 88.02,97 83,97 arc90 80,94 80,78.76 arc45 81.46,75.22 SX3.7 74.69,74.06 arc90 69.69,69.06 R2.1
N$14
  Top 1.27: R14.1 arc-90 134.19,41.77 134.19,39 arc90 139.19,34 145.65,34 arc90 SX2.2
  Bottom 1.27: Z4.2 129.12,60.28 arc45 127.65,56.74 127.65,50.38 arc45 129.12,46.84 R14.1
N$15
  Top 1.27: J13.1 C12O.1
N$16
  Top 1.27: R8.2 104.15,37.33 arc-45 102.69,40.87 102.69,50.46 arc45 101.22,53.99 97.38,57.84 arc45 93.85,59.3 69.21,59.3 arc-45 65.67,60.76 C2O.2 64.99,66.14 arc45 R3O.1
N$17
  Top 1.27: R3O1.1 arc45 172.39,66.14 C2O1.2 171.7,60.76 arc-45 168.17,59.3 138.93,59.3 arc45 135.4,57.84 129.75,52.19 arc45 128.29,48.66 128.29,46.32 arc45 129.36,43.73 arc-45 130.83,40.19 R14.2
N$18
  Top 1.27: C21O.2 C21O.3 | SX1.8 89.11,45.45 arc-45 90.58,48.99 SX1.1
  Bottom 1.27: C21O.2 79.78,18 arc90 84.78,23 D3.1 87.79,33.43 arc45 SX1.8
N$19
  Top 1.27: C12O.2 101.51,111.92 arc-90 106.51,106.92 R20O.1
  Bottom 1.27: R18O.2 98.06,99.4 arc45 101.6,100.86 R20O.1
N$20
  Top 1.27: R28O.2 172.66,85.91 arc45 171.39,88.97 arc-45 170.17,91.91 170.17,109.25 arc45 C15O.2
  Bottom 1.27: R24O.2 R28O.2
N$21
  Top 1.27: J13.4 81.8,115.38 arc-45 80.34,111.85 C13O.1
N$22
  Top 2.54: 90.88,72.3 arc-90 90.88,66.79 arc-45 87.34,65.33 87.15,65.33 arc45 83.61,63.86 U1.3 | 87.65,89.01 arc-45 89.11,85.47 SX3.8 | SX3.3 87.65,89.01 | 87.65,89.01 | SX3.8 90.88,72.3 | 90.88,72.3 | D2.1 102.61,96.68 arc-45 106.99,98.5 arc-90 109.65,95.84 109.65,82.16 arc-45 108.19,78.62 D1.1 | SX3.8
  Bottom 2.54: SX3.8 101.56,74.06 arc45 105.09,75.53 D1.1
N$23
  Top 1.27: D3.2 74.36,30.42 arc45 77.89,31.89 SX1.7 | SX1.7
  Bottom 1.27: R7.1 arc45 72.99,66.05 72.99,63.57 arc45 74.45,60.04 79.68,54.81 arc-135 77.56,49.69 74.69,49.69 arc90 69.69,44.69 69.69,41.62 arc90 74.69,36.62 SX1.7
N$24
  Top 1.27: J13.3 84.34,115.38 arc45 85.81,111.85 C14O.1
N$25
  Top 1.27: R11O.1 70.2,105.26 arc45 73.74,103.8 84.33,103.8 arc45 87.86,105.26 C14O.2 90.13,107.54 arc-45 93.67,109 101.03,109 arc-90 104.03,106 104.03,104.4 arc-45 102.56,100.87 98.7,97.01 arc135 100.29,93.17 102.64,93.17 arc-45 106.18,91.7 R16O.2
N$26
  Top 1.27: R9.2 92.01,30.42 arc-45 88.48,31.89 87.33,33.04 arc-45 85.87,36.57 85.87,38.19 arc45 84.4,41.72 84.09,42.04 arc-45 82.62,45.58 SX1.3
  Bottom 1.27: Z3.1 91.89,49.39 arc-45 88.36,50.85 SX1.3 | SX1.3
N$27
  Top 1.27: Z4.1 132.69,49.39 arc-90 137.69,44.39 137.69,42.07 arc45 139.15,38.54 arc90 145.72,38.54 145.74,38.56 arc-90 152.82,38.56 SX2.3 150.03,31.89 arc-45 146.49,30.42 R15.2
N$28
  Bottom 1.27: C13O.2 75.55,103.56 arc45 74.08,100.02 R14O.2 73.17,99.4 arc-45 69.63,100.86 R21O.2
N$29
  Top 1.27: SX2.7 154.76,43 arc45 156.22,39.47 161.9,33.79 arc-45 D6.2
  Bottom 1.27: SX2.7 158.29,56.59 arc90 163.29,61.59 R13.1
N$30
  Top 1.27: C24O.1 J2.1
N$31
  Top 1.27: R23O.2 139.28,99.4 arc-45 135.74,100.86 R29O.1 130.83,106.92 arc-90 135.83,111.92 C24O.2
N$32
  Top 1.27: J2.4 155.57,115.38 arc45 157.04,111.85 C25O.1
N$33
  Top 1.27: J2.3 153.03,115.38 arc-45 151.57,111.85 C26O.1
N$34
  Top 1.27: R26O.2 131.17,91.7 arc-45 134.7,93.17 136.41,93.17 arc45 139.95,94.63 147.53,102.22 arc45 149,105.75 C26O.2 149.51,105.26 arc45 153.05,103.8 163.64,103.8 arc45 167.17,105.26 R22O.1
N$35
  Top 1.27: 94.36,85.9 arc45 95.83,82.36 96.22,81.96 arc-45 97.69,78.43 97.69,66.95 arc-90 92.69,61.95 R5.1 | SX3.1 94.36,85.9 | 94.36,85.9
N$36
  Bottom 1.27: C25O.2 161.83,103.56 arc-45 163.29,100.02 R25O.2 164.21,99.4 arc45 167.74,100.86 R30O.2
N$37
  Top 1.27: R10.2 71.02,63.86 arc-45 74.56,65.33 75.79,65.33 arc-90 U1.2
N$38
  Top 1.27: R16.2 166.36,63.86 arc45 162.82,65.33 161.59,65.33 arc90 U2.2
N$39
  Top 2.54: C2O.1 64.99,52.13 arc45 66.45,48.6 R17.2 73.16,41.89 arc45 76.69,40.43 SX1.6
N$40
  Top 2.54: C2O1.1 172.39,52.13 arc-45 170.92,48.6 R18.1 169.08,47.84 arc-45 162,50.77 SX2.6
N$41
  Top 1.27: Z2.2 Z1.2
N$42
  Top 1.27: Z5.2 Z6.2
N$43
  Top 4: D9.1 D10.1 C1P.1 219.57,20.66 arc45 223.1,19.2 J6.4
N$44
  Top 4: C2P.1 202.25,24.16 arc-45 203.72,27.69 206.35,30.33 arc-45 209.88,31.79 R6P.2 220.72,31.79 arc-45 224.25,30.33 229.67,24.91 arc45 J6.5
N$45
  Bottom 4: R5P.2 R4P.1 179.13,42.27 arc45 C4P.1 arc45 179.13,38.06 R3P.2 R2P.1
N$46
  Bottom 0.305: IC5.4 221.24,99.27 arc-90 222.24,100.27 J17.1 R8B.2
N$47
  Bottom 0.305: R6B.1 J17.2 223.9,98.38 arc45 223.19,98.68 IC5.5
N$48
  Bottom 0.305: IC5.6 223.19,94.25 arc45 223.9,94.55 J17.3
N$49
  Bottom 0.305: IC1.4 221.24,119.7 arc-90 222.24,120.7 J1.1 R8D.2
N$50
  Bottom 0.305: R6D.1 J1.2 223.9,118.81 arc45 223.19,119.1 IC1.5
N$51
  Bottom 0.305: IC1.6 223.19,114.68 arc45 223.9,114.97 J1.3
N$52
  Bottom 0.305: C19D.1 R7D.1 J1.4 222.24,113.08 arc-90 221.24,114.08 IC1.7
N$53
  Bottom 0.305: IC2.4 196.81,149.59 arc-90 197.81,150.59 J5.1 R8A.2
N$54
  Bottom 0.305: R6A.1 J5.2 199.48,148.7 arc45 198.77,148.99 IC2.5
N$55
  Bottom 0.305: IC2.6 198.77,144.57 arc45 199.48,144.86 J5.3
N$56
  Bottom 0.305: C19A.1 R7A.1 J5.4 197.81,142.97 arc-90 196.81,143.97 IC2.7
N$57
  Top 4: C1P1.1 191.17,85.43 arc45 194.7,83.97 201.88,83.97 arc-90 206.88,78.97 206.88,73 206.88,72.94 | J6.10 211.88,49.2 arc-90 206.88,54.2 206.88,72.94 | D14.1 206.88,72.94
  Bottom 4: D13.1 D14.1
N$58
  Top 4: R6P1.2 201.92,97.48 arc-45 203.38,93.95 C2P1.1 206.11,89.97 arc-45 209.65,88.5 211.52,86.63 arc45 215.05,85.17 215.15,85.17 arc-45 218.69,83.7 229.91,72.48 arc-45 231.38,68.94 J6.11
N$59
  Top 4: J4.8 14.27,19.2 arc45 17.81,20.66 C1P2.1 D18.1 D17.1
N$60
  Top 4: C2P2.1 35.12,24.16 arc45 33.66,27.69 31.03,30.33 arc45 27.49,31.79 R6P2.2 16.66,31.79 arc45 13.13,30.33 7.71,24.91 arc-45 J4.7
N$61
  Bottom 4: R5P1.2 R4P1.1 58.24,42.27 arc-45 C4P1.1 arc-45 58.24,38.06 R3P1.2 R2P1.1
N$62
  Top 4: C1P3.1 46.21,85.43 arc-45 42.67,83.97 35.5,83.97 arc90 30.5,78.97 30.5,72.94 | J4.2 25.5,49.2 arc90 30.5,54.2 30.5,72.94 | D22.1 30.5,72.94
  Bottom 4: D21.1 D22.1
N$63
  Bottom 0.305: IC6.4 16.14,93.65 arc-90 15.14,92.65 J8.1 R8B2.2
N$64
  Bottom 0.305: C19B2.1 R7B2.1 J8.4 15.14,100.27 arc-90 16.14,99.27 IC6.7
N$65
  Bottom 0.305: R6B2.1 J8.2 13.48,94.55 arc45 14.18,94.25 IC6.5
N$66
  Bottom 0.305: IC6.6 14.18,98.68 arc45 13.48,98.38 J8.3
N$67
  Top 4: R6P3.2 35.46,97.48 arc45 33.99,93.95 C2P3.1 32.27,89.97 arc45 28.73,88.5 25.66,85.43 arc-45 22.12,83.97 21.02,83.97 arc45 17.49,82.5 7.46,72.48 arc45 6,68.94 J4.1
N$71
  Bottom 0.305: IC8.4 18.64,114.08 arc-90 17.64,113.08 J10.1 R8B4.2
N$72
  Bottom 0.305: C19B4.1 R7B4.1 J10.4 17.64,120.7 arc-90 18.64,119.7 IC8.7
N$73
  Bottom 0.305: R6B4.1 J10.2 15.98,114.97 arc45 16.68,114.68 IC8.5
N$74
  Bottom 0.305: IC8.6 16.68,119.1 arc45 15.98,118.81 J10.3
N$79
  Bottom 0.305: IC10.4 40.56,143.97 arc-90 39.56,142.97 J12.1 R8B6.2
N$80
  Bottom 0.305: C19B6.1 R7B6.1 J12.4 39.56,150.59 arc-90 40.56,149.59 IC10.7
N$81
  Bottom 0.305: R6B6.1 J12.2 37.9,144.86 arc45 38.61,144.57 IC10.5
N$82
  Bottom 0.305: IC10.6 38.61,148.99 arc45 37.9,148.7 J12.3
N$103
  Bottom 0.305: C19B.1 R7B.1 J17.4 222.24,92.65 arc-90 221.24,93.65 IC5.7
R+
  Top 1.27: R2.2 68.67,77.97 arc-45 67.2,81.5 67.2,82.94 arc-45 68.67,86.48 68.92,86.73 arc45 69.69,88.59 R12O.1 78.56,100.24 arc-45 82.1,101.7 83.08,101.7 arc-45 86.61,100.24 R18O.1
R-
  Top 1.27: R1.2 101.54,88.95 arc45 103.51,84.21 R16O.1
  Bottom 1.27: R14O.1 85.08,98.56 arc45 88.61,97.1 94.24,97.1 arc-45 96.92,95.99 R1.2
R_OUT
  Top 1.27: C21O.4 C21O.1 | Z2.1 C21O.1 | C21O.1 111.72,18 arc45 115.25,19.46 J3.3 116.29,27.1 arc-45 117.75,30.63 R20O1.2
VCC/1
  Top 4: C5P3.1 C6P3.1 arc-45 36.55,110.02 44.59,101.99 arc45 48.13,100.53 R6P3.1 56.78,103.57 arc45 58.24,107.1 C7P3.1 C3P3.1
  Bottom 0.305: IC6.3 16.64,92.05 arc-45 16.35,91.34 R8B2.1 | IC8.3 19.14,112.47 arc-45 18.85,111.76 R8B4.1 | IC10.3 41.06,142.37 arc-45 40.77,141.66 R8B6.1
  Bottom 1.272: C21B2.1 J8.8 C20B2.1 20.45,87.25 arc-90 19.45,86.25 11.63,86.25 arc-90 6.63,91.25 6.63,106.68 | C21B4.1 J10.8 C20B4.1 22.95,107.68 arc-90 21.95,106.68 6.63,106.68 | C21B6.1 J12.8 C20B6.1 44.87,137.8 arc-90 42.87,135.8 40.44,135.8 arc45 36.91,134.34 33.99,131.42 | 6.63,106.68 6.63,121.17 arc-45 8.1,124.71 9.76,126.37 arc-45 13.29,127.83 C5P3.1 33.99,131.42 | 33.99,131.42 31.84,133.57 arc-45 C6.1 arc-90 28.23,137.42 IC4.3
  pour Bottom (no thermals): 40.89,145.28 40.89,142.45 arc90 41.89,141.45 45.39,141.45 arc90 46.39,142.45 46.39,145.71 arc90 45.39,146.71 43.44,146.71 arc90 42.73,145.99 arc-90 42.02,145.28
  pour Bottom (no thermals): 16.46,94.96 16.46,92.13 arc90 17.46,91.13 20.97,91.13 arc90 21.97,92.13 21.97,95.39 arc90 20.97,96.39 19.02,96.39 arc90 18.31,95.68 arc-90 17.6,94.96
  pour Bottom (no thermals): 18.96,115.39 18.96,112.56 arc90 19.96,111.56 23.47,111.56 arc90 24.47,112.56 24.47,115.81 arc90 23.47,116.81 21.52,116.81 arc90 20.81,116.1 arc-90 20.1,115.39
VCC/2
  Top 4: C3P1.1 C7P1.1 179.13,107.1 arc45 180.6,103.57 R6P1.1 189.25,100.53 arc45 192.79,101.99 200.82,110.02 arc-45 C6P1.1 C5P1.1
  Bottom 0.305: IC1.3 220.74,121.31 arc-45 221.03,122.01 R8D.1 | IC5.3 220.74,100.88 arc-45 221.03,101.59 R8B.1
  Bottom 1.272: C21D.1 J1.8 C20D.1 216.93,127.83 | C21B.1 J17.8 C20B.1 216.93,105.68 arc-90 217.93,106.68 228.74,106.68 arc90 230.74,108.68 230.74,121.17 arc45 229.28,124.71 227.62,126.37 arc45 224.08,127.83 216.93,127.83 | 216.93,127.83 216.69,127.83 C5P1.1 203.38,131.66 arc-90 C7.1 206.69,133.98 arc-90 IC3.3
  pour Bottom (no thermals): 220.91,118.39 220.91,121.22 arc90 219.91,122.22 216.41,122.22 arc90 215.41,121.22 215.41,117.96 arc90 216.41,116.96 218.36,116.96 arc90 219.07,117.68 arc-90 219.78,118.39
  pour Bottom (no thermals): 220.91,97.96 220.91,100.79 arc90 219.91,101.79 216.41,101.79 arc90 215.41,100.79 215.41,97.54 arc90 216.41,96.54 218.36,96.54 arc90 219.07,97.25 arc-90 219.78,97.96